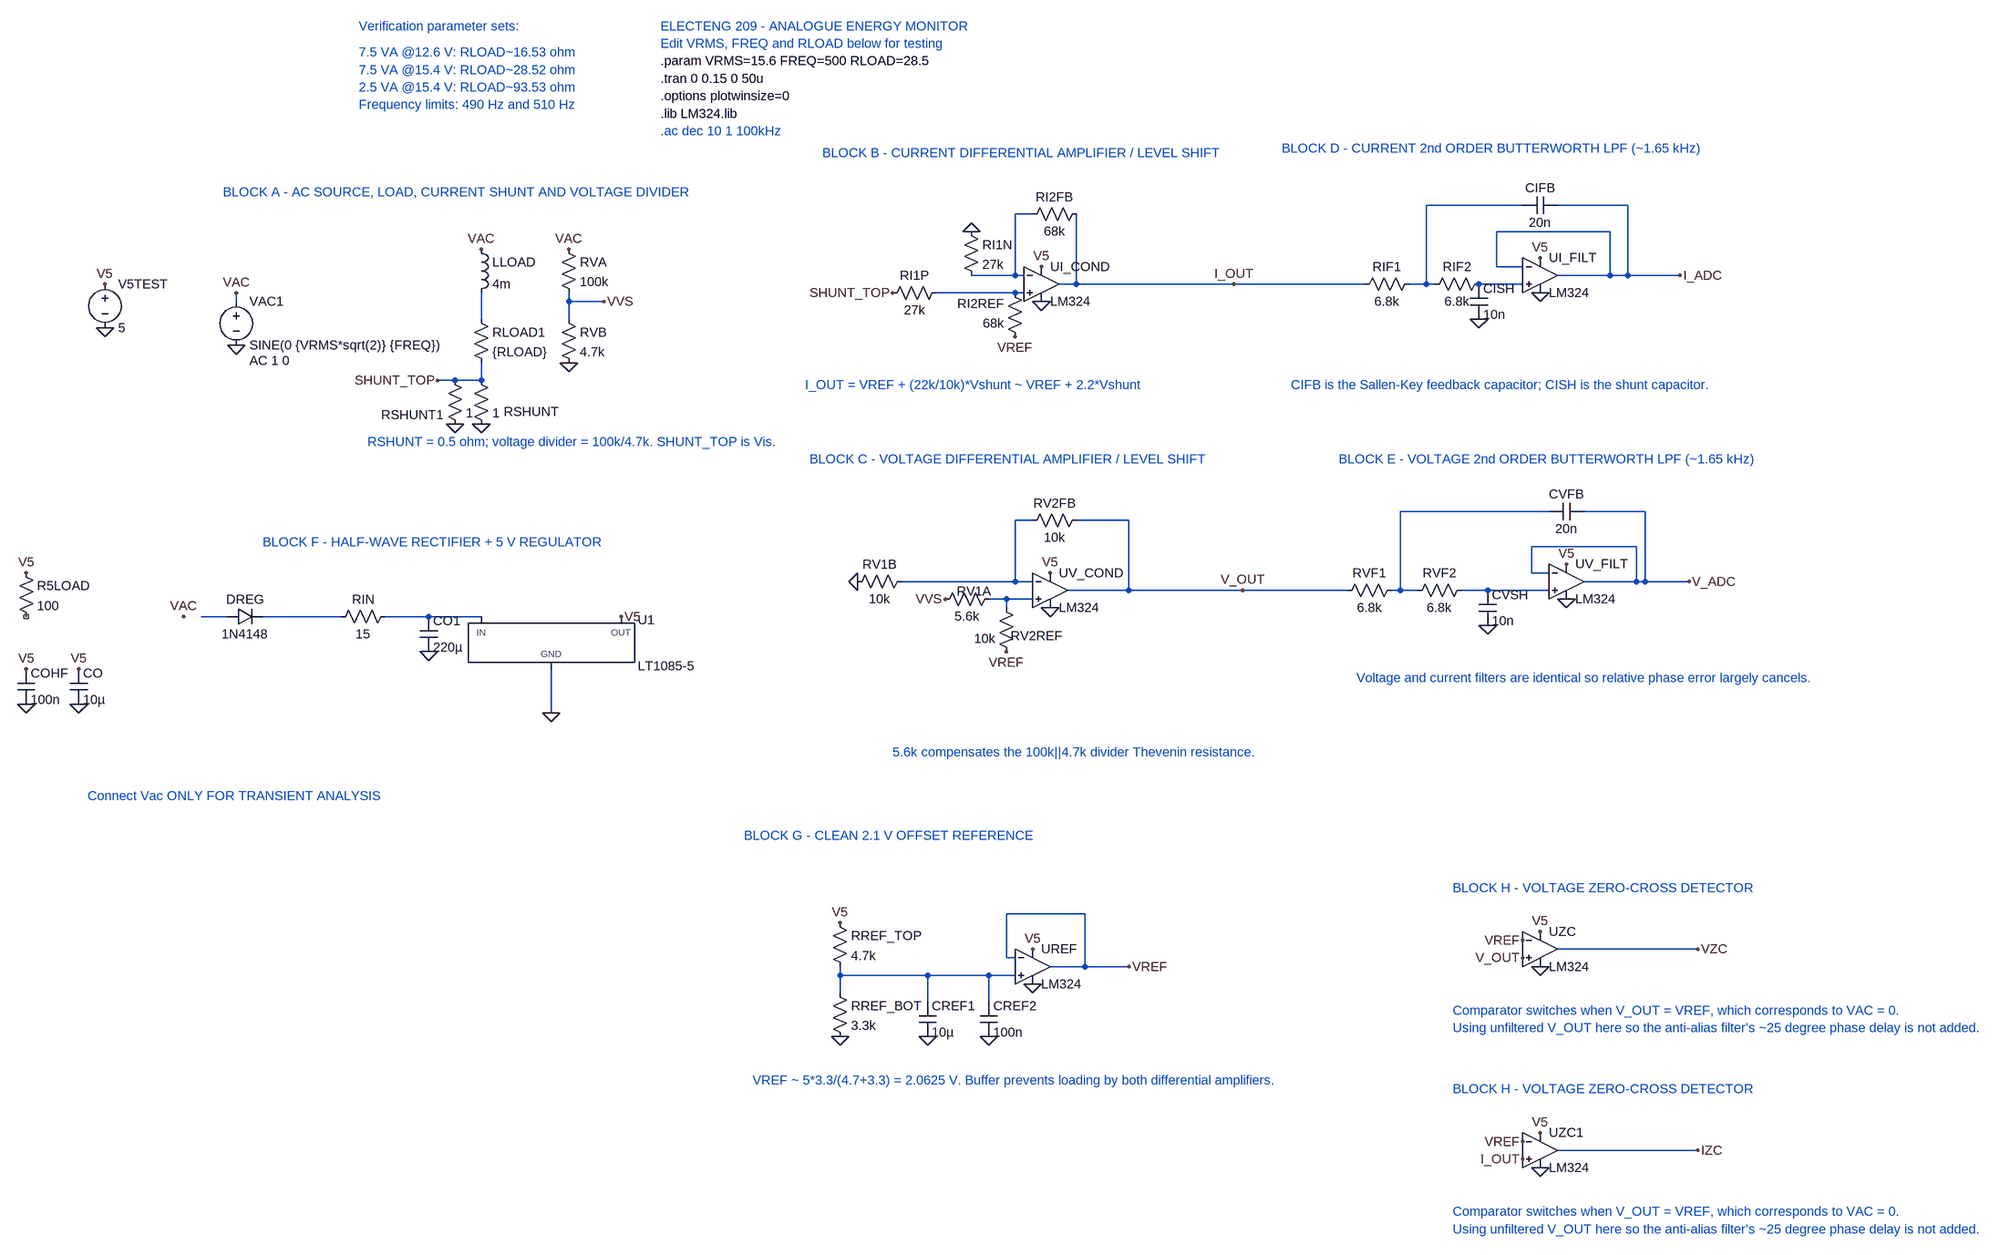
[diagram p0: schematic MASTER_SCHEMATIC_EE209.asc]
MASTER_SCHEMATIC_EE209.asc, the LTspice schematic file:
Version 4.1
SHEET 1 5156 2208
WIRE 1648 224 1472 224
WIRE 1840 224 1712 224
WIRE 752 240 720 240
WIRE 1808 272 1600 272
WIRE 1600 336 1600 272
WIRE 1648 336 1600 336
WIRE 720 352 720 240
WIRE 720 352 640 352
WIRE 736 352 720 352
WIRE 1808 352 1808 272
WIRE 1808 352 1712 352
WIRE 1840 352 1840 224
WIRE 1840 352 1808 352
WIRE 1936 352 1840 352
WIRE 832 368 832 240
WIRE 832 368 800 368
WIRE 1120 368 832 368
WIRE 1360 368 1120 368
WIRE 1472 368 1472 224
WIRE 1472 368 1440 368
WIRE 1488 368 1472 368
WIRE 1648 368 1568 368
WIRE 720 384 576 384
WIRE 736 384 720 384
WIRE -704 400 -704 384
WIRE -96 400 -96 384
WIRE -32 400 -96 400
WIRE -256 432 -256 384
WIRE -96 432 -96 400
WIRE -304 544 -336 544
WIRE -256 544 -256 512
WIRE -256 544 -304 544
WIRE 1696 784 1424 784
WIRE 1872 784 1760 784
WIRE 752 800 720 800
WIRE 928 800 832 800
WIRE 1856 848 1664 848
WIRE 1664 896 1664 848
WIRE 1696 896 1664 896
WIRE 720 912 720 800
WIRE 720 912 512 912
WIRE 752 912 720 912
WIRE 1856 912 1856 848
WIRE 1856 912 1760 912
WIRE 1872 912 1872 784
WIRE 1872 912 1856 912
WIRE 1952 912 1872 912
WIRE 928 928 928 800
WIRE 928 928 816 928
WIRE 1136 928 928 928
WIRE 1328 928 1136 928
WIRE 1424 928 1424 784
WIRE 1424 928 1408 928
WIRE 1456 928 1424 928
WIRE 1584 928 1536 928
WIRE 1696 928 1584 928
WIRE 704 944 672 944
WIRE 752 944 704 944
WIRE 704 960 704 944
WIRE -720 976 -768 976
WIRE -512 976 -656 976
WIRE -352 976 -432 976
WIRE -256 976 -352 976
WIRE -128 1152 -128 1072
WIRE 848 1520 704 1520
WIRE 1968 1584 1712 1584
WIRE 704 1600 704 1520
WIRE 720 1600 704 1600
WIRE 848 1616 848 1520
WIRE 848 1616 784 1616
WIRE 928 1616 848 1616
WIRE 400 1632 400 1616
WIRE 560 1632 400 1632
WIRE 672 1632 560 1632
WIRE 720 1632 672 1632
WIRE 400 1664 400 1632
WIRE 560 1680 560 1632
WIRE 672 1680 672 1632
WIRE 1968 1952 1712 1952
FLAG -704 384 VAC
FLAG -704 480 0
FLAG -256 304 VAC
FLAG -336 544 SHUNT_TOP
FLAG -256 624 0
FLAG -96 304 VAC
FLAG -32 400 VVS
FLAG -96 512 0
FLAG 496 384 SHUNT_TOP
FLAG 720 464 VREF
FLAG 640 272 0
FLAG 768 336 V5
FLAG 768 400 0
FLAG 592 944 VVS
FLAG 704 1040 VREF
FLAG -992 1136 0
FLAG 784 896 V5
FLAG 784 960 0
FLAG 1568 432 0
FLAG 1680 320 V5
FLAG 1680 384 0
FLAG 1584 992 0
FLAG 1728 880 V5
FLAG 1728 944 0
FLAG -800 976 VAC
FLAG -352 1040 0
FLAG 0 976 V5
FLAG -992 1072 V5
FLAG 432 912 0
FLAG -1088 1072 V5
FLAG -1088 1136 0
FLAG -1088 896 V5
FLAG 400 1536 V5
FLAG 400 1744 0
FLAG 560 1744 0
FLAG 672 1744 0
FLAG 752 1584 V5
FLAG 752 1648 0
FLAG 1648 1600 V_OUT
FLAG 1648 1568 VREF
FLAG 1680 1552 V5
FLAG 1680 1616 0
FLAG 1968 1584 VZC
FLAG 928 1616 VREF
FLAG 1136 928 V_OUT
FLAG 1120 368 I_OUT
FLAG -304 624 0
FLAG -128 1152 0
FLAG 1952 912 V_ADC
FLAG 1936 352 I_ADC
FLAG -944 448 0
FLAG -944 368 V5
FLAG 1648 1968 I_OUT
FLAG 1648 1936 VREF
FLAG 1680 1920 V5
FLAG 1680 1984 0
FLAG 1968 1952 IZC
SYMBOL voltage -704 384 R0
WINDOW 123 24 124 Left 2
WINDOW 39 0 0 Left 0
SYMATTR Value2 AC 1 0
SYMATTR InstName VAC1
SYMATTR Value SINE(0 {VRMS*sqrt(2)} {FREQ})
SYMBOL ind -272 288 R0
SYMATTR InstName LLOAD
SYMATTR Value 4m
SYMBOL res -272 416 R0
SYMATTR InstName RLOAD1
SYMATTR Value {RLOAD}
SYMBOL res -272 528 R0
WINDOW 0 57 73 Left 2
SYMATTR InstName RSHUNT
SYMATTR Value 1
SYMBOL res -112 288 R0
SYMATTR InstName RVA
SYMATTR Value 100k
SYMBOL res -112 416 R0
SYMATTR InstName RVB
SYMATTR Value 4.7k
SYMBOL res 480 400 R270
WINDOW 0 32 56 VTop 2
WINDOW 3 0 56 VBottom 2
SYMATTR InstName RI1P
SYMATTR Value 27k
SYMBOL res 736 480 R180
WINDOW 0 36 76 Left 2
WINDOW 3 36 40 Left 2
SYMATTR InstName RI2REF
SYMATTR Value 68k
SYMBOL res 624 256 R0
SYMATTR InstName RI1N
SYMATTR Value 27k
SYMBOL res 848 224 R90
WINDOW 0 0 56 VBottom 2
WINDOW 3 32 56 VTop 2
SYMATTR InstName RI2FB
SYMATTR Value 68k
SYMBOL opamps\\opamp2 768 304 R0
SYMATTR InstName UI_COND
SYMATTR Value LM324
SYMBOL res 576 960 R270
WINDOW 0 15 69 VTop 2
WINDOW 3 0 56 VBottom 2
SYMATTR InstName RV1A
SYMATTR Value 5.6k
SYMBOL res 720 1056 R180
WINDOW 0 -86 45 Left 2
WINDOW 3 36 40 Left 2
SYMATTR InstName RV2REF
SYMATTR Value 10k
SYMBOL res 416 928 R270
WINDOW 0 32 56 VTop 2
WINDOW 3 0 56 VBottom 2
SYMATTR InstName RV1B
SYMATTR Value 10k
SYMBOL res 848 784 R90
WINDOW 0 0 56 VBottom 2
WINDOW 3 32 56 VTop 2
SYMATTR InstName RV2FB
SYMATTR Value 10k
SYMBOL opamps\\opamp2 784 864 R0
SYMATTR InstName UV_COND
SYMATTR Value LM324
SYMBOL res 1344 384 R270
WINDOW 0 32 56 VTop 2
WINDOW 3 0 56 VBottom 2
SYMATTR InstName RIF1
SYMATTR Value 6.8k
SYMBOL res 1472 384 R270
WINDOW 0 32 56 VTop 2
WINDOW 3 0 56 VBottom 2
SYMATTR InstName RIF2
SYMATTR Value 6.8k
SYMBOL cap 1648 240 R270
WINDOW 0 32 32 VTop 2
WINDOW 3 0 32 VBottom 2
SYMATTR InstName CIFB
SYMATTR Value 20n
SYMBOL cap 1552 368 R0
SYMATTR InstName CISH
SYMATTR Value 10n
SYMBOL opamps\\opamp2 1680 288 R0
SYMATTR InstName UI_FILT
SYMATTR Value LM324
SYMBOL res 1424 912 R90
WINDOW 0 0 56 VBottom 2
WINDOW 3 32 56 VTop 2
SYMATTR InstName RVF1
SYMATTR Value 6.8k
SYMBOL res 1552 912 R90
WINDOW 0 0 56 VBottom 2
WINDOW 3 32 56 VTop 2
SYMATTR InstName RVF2
SYMATTR Value 6.8k
SYMBOL cap 1760 768 R90
WINDOW 0 0 32 VBottom 2
WINDOW 3 32 32 VTop 2
SYMATTR InstName CVFB
SYMATTR Value 20n
SYMBOL cap 1568 928 R0
SYMATTR InstName CVSH
SYMATTR Value 10n
SYMBOL opamps\\opamp2 1728 848 R0
SYMATTR InstName UV_FILT
SYMATTR Value LM324
SYMBOL diode -720 992 R270
WINDOW 0 32 32 VTop 2
WINDOW 3 0 32 VBottom 2
SYMATTR InstName DREG
SYMATTR Value 1N4148
SYMBOL res -528 992 R270
WINDOW 0 32 56 VTop 2
WINDOW 3 0 56 VBottom 2
SYMATTR InstName RIN
SYMATTR Value 15
SYMBOL cap -1104 1072 R0
SYMATTR InstName COHF
SYMATTR Value 100n
SYMBOL res -1104 880 R0
SYMATTR InstName R5LOAD
SYMATTR Value 100
SYMBOL res 384 1520 R0
SYMATTR InstName RREF_TOP
SYMATTR Value 4.7k
SYMBOL res 384 1648 R0
SYMATTR InstName RREF_BOT
SYMATTR Value 3.3k
SYMBOL cap 656 1680 R0
SYMATTR InstName CREF2
SYMATTR Value 100n
SYMBOL opamps\\opamp2 752 1552 R0
SYMATTR InstName UREF
SYMATTR Value LM324
SYMBOL opamps\\opamp2 1680 1520 R0
SYMATTR InstName UZC
SYMATTR Value LM324
SYMBOL res -320 528 R0
WINDOW 0 -119 79 Left 2
SYMATTR InstName RSHUNT1
SYMATTR Value 1
SYMBOL PowerProducts\\LT1085-5 -128 976 R0
SYMATTR InstName U1
SYMBOL cap 544 1680 R0
SYMATTR InstName CREF1
SYMATTR Value 10µ
SYMBOL cap -1008 1072 R0
SYMATTR InstName CO
SYMATTR Value 10µ
SYMBOL voltage -944 352 R0
WINDOW 123 0 0 Left 0
WINDOW 39 0 0 Left 0
SYMATTR InstName V5TEST
SYMATTR Value 5
SYMBOL opamps\\opamp2 1680 1888 R0
SYMATTR InstName UZC1
SYMATTR Value LM324
SYMBOL cap -368 976 R0
SYMATTR InstName CO1
SYMATTR Value 220µ
TEXT 72 -104 Left 2 ;ELECTENG 209 - ANALOGUE ENERGY MONITOR
TEXT 72 -72 Left 2 ;Edit VRMS, FREQ and RLOAD below for testing
TEXT 72 -40 Left 2 !.param VRMS=15.6 FREQ=500 RLOAD=28.5
TEXT 72 -8 Left 2 !.tran 0 0.15 0 50u
TEXT 72 24 Left 2 !.options plotwinsize=0
TEXT -728 200 Left 2 ;BLOCK A - AC SOURCE, LOAD, CURRENT SHUNT AND VOLTAGE DIVIDER
TEXT -464 656 Left 2 ;RSHUNT = 0.5 ohm; voltage divider = 100k/4.7k. SHUNT_TOP is Vis.
TEXT 368 128 Left 2 ;BLOCK B - CURRENT DIFFERENTIAL AMPLIFIER / LEVEL SHIFT
TEXT 336 552 Left 2 ;I_OUT = VREF + (22k/10k)*Vshunt ~ VREF + 2.2*Vshunt
TEXT 344 688 Left 2 ;BLOCK C - VOLTAGE DIFFERENTIAL AMPLIFIER / LEVEL SHIFT
TEXT 496 1224 Left 2 ;5.6k compensates the 100k||4.7k divider Thevenin resistance.
TEXT 1208 120 Left 2 ;BLOCK D - CURRENT 2nd ORDER BUTTERWORTH LPF (~1.65 kHz)
TEXT 1224 552 Left 2 ;CIFB is the Sallen-Key feedback capacitor; CISH is the shunt capacitor.
TEXT 1312 688 Left 2 ;BLOCK E - VOLTAGE 2nd ORDER BUTTERWORTH LPF (~1.65 kHz)
TEXT 1344 1088 Left 2 ;Voltage and current filters are identical so relative phase error largely cancels.
TEXT -656 840 Left 2 ;BLOCK F - HALF-WAVE RECTIFIER + 5 V REGULATOR
TEXT -976 1304 Left 2 ;Connect Vac ONLY FOR TRANSIENT ANALYSIS
TEXT 224 1376 Left 2 ;BLOCK G - CLEAN 2.1 V OFFSET REFERENCE
TEXT 240 1824 Left 2 ;VREF ~ 5*3.3/(4.7+3.3) = 2.0625 V. Buffer prevents loading by both differential amplifiers.
TEXT 1520 1472 Left 2 ;BLOCK H - VOLTAGE ZERO-CROSS DETECTOR
TEXT 1520 1696 Left 2 ;Comparator switches when V_OUT = VREF, which corresponds to VAC = 0.
TEXT 1520 1728 Left 2 ;Using unfiltered V_OUT here so the anti-alias filter's ~25 degree phase delay is not added.
TEXT -480 -104 Left 2 ;Verification parameter sets:
TEXT -480 -56 Left 2 ;7.5 VA @12.6 V: RLOAD~16.53 ohm
TEXT -480 -24 Left 2 ;7.5 VA @15.4 V: RLOAD~28.52 ohm
TEXT -480 8 Left 2 ;2.5 VA @15.4 V: RLOAD~93.53 ohm
TEXT -480 40 Left 2 ;Frequency limits: 490 Hz and 510 Hz
TEXT 72 56 Left 2 !.lib LM324.lib
TEXT 72 88 Left 2 ;.ac dec 10 1 100kHz
TEXT 1520 1840 Left 2 ;BLOCK H - VOLTAGE ZERO-CROSS DETECTOR
TEXT 1520 2064 Left 2 ;Comparator switches when V_OUT = VREF, which corresponds to VAC = 0.
TEXT 1520 2096 Left 2 ;Using unfiltered V_OUT here so the anti-alias filter's ~25 degree phase delay is not added.

The netlist it stands for:
* MASTER_SCHEMATIC_EE209.asc
VAC1 VAC 0 SINE(0 {VRMS*sqrt(2)} {FREQ}) AC 1 0
LLOAD VAC N005 4m
RLOAD1 N005 SHUNT_TOP {RLOAD}
RSHUNT SHUNT_TOP 0 1
RVA VAC VVS 100k
RVB VVS 0 4.7k
RI1P SHUNT_TOP N004 27k
RI2REF VREF N004 68k
RI1N 0 N002 27k
RI2FB I_OUT N002 68k
X§UI_COND N004 N002 V5 0 I_OUT LM324  ; pins In+ In- V+ V- OUT
RV1A VVS N009 5.6k
RV2REF VREF N009 10k
RV1B 0 N007 10k
RV2FB V_OUT N007 10k
X§UV_COND N009 N007 V5 0 V_OUT LM324  ; pins In+ In- V+ V- OUT
RIF1 I_OUT N001 6.8k
RIF2 N001 N003 6.8k
CIFB N001 I_ADC 20n
CISH N003 0 10n
X§UI_FILT N003 I_ADC V5 0 I_ADC LM324  ; pins In+ In- V+ V- OUT
RVF1 N006 V_OUT 6.8k
RVF2 N008 N006 6.8k
CVFB V_ADC N006 20n
CVSH N008 0 10n
X§UV_FILT N008 V_ADC V5 0 V_ADC LM324  ; pins In+ In- V+ V- OUT
DREG N010 N011 1N4148
RIN N011 N012 15
COHF V5 0 100n
R5LOAD V5 NC_01 100
RREF_TOP V5 N013 4.7k
RREF_BOT N013 0 3.3k
CREF2 N013 0 100n
X§UREF N013 VREF V5 0 VREF LM324  ; pins In+ In- V+ V- OUT
X§UZC V_OUT VREF V5 0 VZC LM324  ; pins In+ In- V+ V- OUT
RSHUNT1 SHUNT_TOP 0 1
X§U1 0 V5 N012 LT1085-5  ; pins GND OUT IN
CREF1 N013 0 10µ
CO V5 0 10µ
V5TEST V5 0 5
X§UZC1 I_OUT VREF V5 0 IZC LM324  ; pins In+ In- V+ V- OUT
CO1 N012 0 220µ
.model D D
.lib standard.dio
* ELECTENG 209 - ANALOGUE ENERGY MONITOR
* Edit VRMS, FREQ and RLOAD below for testing
.param VRMS=15.6 FREQ=500 RLOAD=28.5
.tran 0 0.15 0 50u
.options plotwinsize=0
* BLOCK A - AC SOURCE, LOAD, CURRENT SHUNT AND VOLTAGE DIVIDER
* RSHUNT = 0.5 ohm; voltage divider = 100k/4.7k. SHUNT_TOP is Vis.
* BLOCK B - CURRENT DIFFERENTIAL AMPLIFIER / LEVEL SHIFT
* I_OUT = VREF + (22k/10k)*Vshunt ~ VREF + 2.2*Vshunt
* BLOCK C - VOLTAGE DIFFERENTIAL AMPLIFIER / LEVEL SHIFT
* 5.6k compensates the 100k||4.7k divider Thevenin resistance.
* BLOCK D - CURRENT 2nd ORDER BUTTERWORTH LPF (~1.65 kHz)
* CIFB is the Sallen-Key feedback capacitor; CISH is the shunt capacitor.
* BLOCK E - VOLTAGE 2nd ORDER BUTTERWORTH LPF (~1.65 kHz)
* Voltage and current filters are identical so relative phase error largely cancels.
* BLOCK F - HALF-WAVE RECTIFIER + 5 V REGULATOR
* Connect Vac ONLY FOR TRANSIENT ANALYSIS
* BLOCK G - CLEAN 2.1 V OFFSET REFERENCE
* VREF ~ 5*3.3/(4.7+3.3) = 2.0625 V. Buffer prevents loading by both differential amplifiers.
* BLOCK H - VOLTAGE ZERO-CROSS DETECTOR
* Comparator switches when V_OUT = VREF, which corresponds to VAC = 0.
* Using unfiltered V_OUT here so the anti-alias filter's ~25 degree phase delay is not added.
* Verification parameter sets:
* 7.5 VA @12.6 V: RLOAD~16.53 ohm
* 7.5 VA @15.4 V: RLOAD~28.52 ohm
* 2.5 VA @15.4 V: RLOAD~93.53 ohm
* Frequency limits: 490 Hz and 510 Hz
.lib LM324.lib
* .ac dec 10 1 100kHz
* BLOCK H - VOLTAGE ZERO-CROSS DETECTOR
* Comparator switches when V_OUT = VREF, which corresponds to VAC = 0.
* Using unfiltered V_OUT here so the anti-alias filter's ~25 degree phase delay is not added.
.backanno
.end